# Altium schematic sheet power.SchDoc
size A4
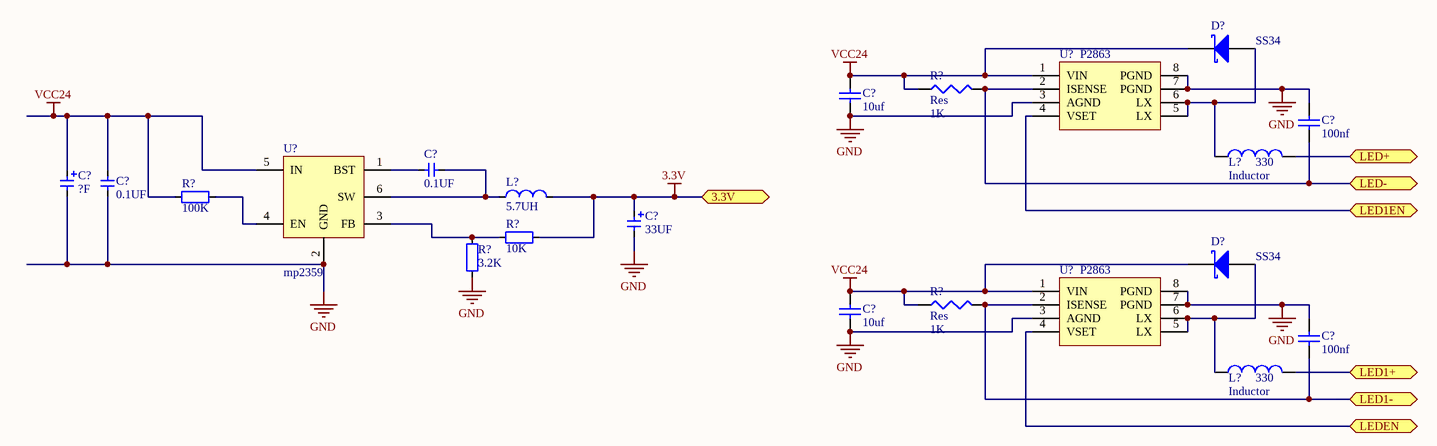
[diagram p0: power.SchDoc]

## Parts
(Parts that share a designator on the sheet are numbered #1, #2 ... from top to bottom, then left to right.)
C?#1  value 10uf  [1210]  (hidden comment: Cap)
C?#2  value 100nf  [C0805]  (hidden comment: Cap)
C?#3  value 0.1UF  [CAP_0603]  (hidden comment: Cap_0603)
C?#4  value ?F  [CAPAE6666X77M]  (hidden comment: Cap_63*77)
C?#5  value 0.1UF  [CAP_0603]  (hidden comment: Cap_0603)
C?#6  value 33UF  [CAP_TAN_A1206]  (hidden comment: Cap_Tan_1206)
C?#7  value 10uf  [1210]  (hidden comment: Cap)
C?#8  value 100nf  [C0805]  (hidden comment: Cap)
D?#1  SS34  [SMB]
D?#2  SS34  [SMB]
L?#1  Inductor  value 330  [ZIC-L10*10*4]
L?#2  value 5.7UH  [IND_CD32]  (hidden comment: Ind_CD32)
L?#3  Inductor  value 330  [ZIC-L10*10*4]
R?#1  Res  value 1K  [1206]
R?#2  value 100K  [RES_0603]  (hidden comment: Res_0603)
R?#3  value 10K  [RES_0603]  (hidden comment: Res_0603)
R?#4  value 3.2K  [RES_0603]  (hidden comment: Res_0603)
R?#5  Res  value 1K  [1206]
U?#1  P2863  [SOP-8]
U?#2  mp2359
U?#3  P2863  [SOP-8]

## Ports
3.3V, LED1+, LED1-, LED1EN, LED+, LED-, LEDEN

## Nets
3.3V: C?#6.1 L?#2.2 R?#3.2 ; port 3.3V
GND: C?#1.1 C?#2.2 C?#4.2 C?#5.1 C?#6.2 C?#7.1 C?#8.2 R?#4.1 U?#1.3(AGND) U?#1.7(PGND) U?#1.8(PGND) U?#2.2(GND) U?#3.3(AGND) U?#3.7(PGND) U?#3.8(PGND)
VCC24: C?#1.2 C?#4.1 C?#5.2 C?#7.2 D?#1.2(K) D?#2.2(K) R?#1.1 R?#2.1 R?#5.1 U?#1.1(VIN) U?#2.5(IN) U?#3.1(VIN)
LED1+: L?#3.2 ; port LED1+
LED1-: C?#8.1 R?#5.2 U?#3.2(ISENSE) ; port LED1-
LED1EN: U?#1.4(VSET) ; port LED1EN
LED+: L?#1.2 ; port LED+
LED-: C?#2.1 R?#1.2 U?#1.2(ISENSE) ; port LED-
LEDEN: U?#3.4(VSET) ; port LEDEN
NetC?#3_1: C?#3.1 U?#2.1(BST)
NetC?#3_2: C?#3.2 L?#2.1 U?#2.6(SW)
NetD?#1_1: D?#1.1(A) L?#1.1 U?#1.5(LX) U?#1.6(LX)
NetD?#2_1: D?#2.1(A) L?#3.1 U?#3.5(LX) U?#3.6(LX)
NetR?#2_2: R?#2.2 U?#2.4(EN)
NetR?#3_1: R?#3.1 R?#4.2 U?#2.3(FB)

## Library data of the parts
C?#1 C?#7 = Cap: Capacitor; Published: 8-Jun-2000; LatestRevisionDate: 17-Jul-2002; LatestRevisionNote: Re-released for DXP Platform.; PackageReference: RAD-0.3; Publisher: Altium Limited; PackageDescription: Radial Cap, Thru-Hole; 2 Leads; 0.3 in Pin Spacing
C?#2 C?#8 = Cap0805: Capacitor (Semiconductor SIM Model); Published: 8-Jun-2000; LatestRevisionDate: 29-May-2009; LatestRevisionNote: IPC-7351 Footprint Added.; PackageReference: C1206; Publisher: Altium Limited; PackageDescription: Chip Capacitor
C?#3 C?#5 = Cap_0603: Capacitor
C?#4 = Cap_Tan_0805: Capacitor
C?#6 = Cap_Tan_1206: Capacitor
D?#1 D?#2 = D Schottky: Schottky Diode; Published: 8-Jun-2000; LatestRevisionDate: 17-Jul-2002; LatestRevisionNote: Re-released for DXP Platform.; PackageReference: SMB; Publisher: Altium Limited; PackageDescription: DO-214-AA/SMB; 2 C-Bend Leads; Body 5.3 x 3.6 mm, inc. leads (LxW); Code_JEDEC: DO-214-AA
L?#1 L?#3 = Inductor: Code_IEC: 1005; Published: 8-Jun-2000; LatestRevisionDate: 29-May-2009; LatestRevisionNote: IPC-7351 Footprint Added.; PackageReference: 0402-A; Publisher: Altium Limited; PackageDescription: Chip Inductor; Code_JEITA: 0402
L?#2 = Ind_CD32: Inductor
R?#1 R?#5 = Res1206: Resistor; Published: 8-Jun-2000; LatestRevisionDate: 29-May-2009; LatestRevisionNote: IPC-7351 Footprint Added.; PackageReference: J1-0603; Publisher: Altium Limited; PackageDescription: Chip Resistor
R?#2-R?#4 = Res_0603: Resistor
U?#1 U?#3 = P: LED Driver,SOP-8